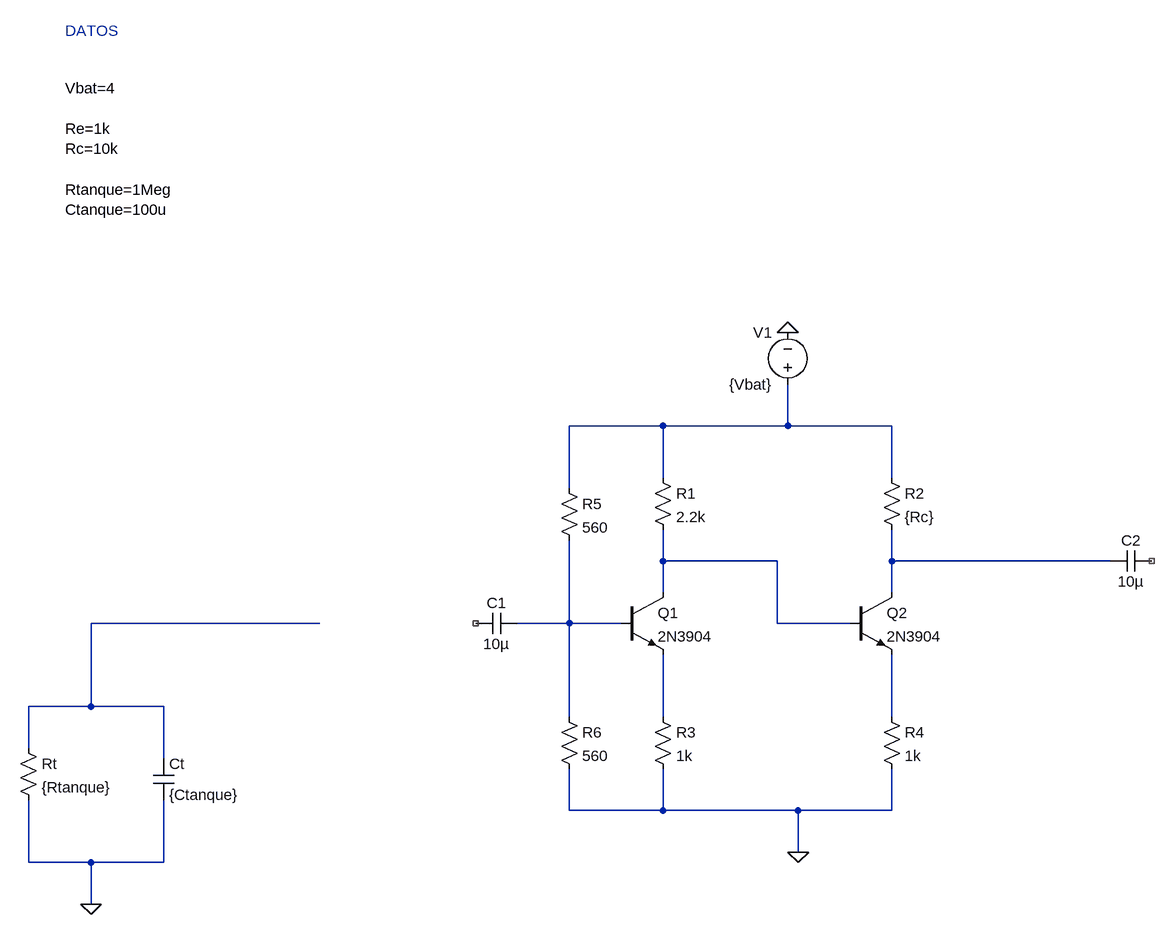
[diagram p0: schematic Draft12.asc]
Draft12.asc, the LTspice schematic file:
Version 4
SHEET 1 1752 680
WIRE 992 -368 848 -368
WIRE 1184 -368 1184 -432
WIRE 1184 -368 992 -368
WIRE 1344 -368 1184 -368
WIRE 992 -288 992 -368
WIRE 1344 -288 1344 -368
WIRE 848 -272 848 -368
WIRE 992 -160 992 -208
WIRE 1168 -160 992 -160
WIRE 1344 -160 1344 -208
WIRE 1680 -160 1344 -160
WIRE 992 -112 992 -160
WIRE 1344 -112 1344 -160
WIRE 464 -64 112 -64
WIRE 848 -64 848 -192
WIRE 848 -64 768 -64
WIRE 928 -64 848 -64
WIRE 1168 -64 1168 -160
WIRE 1280 -64 1168 -64
WIRE 112 64 112 -64
WIRE 112 64 16 64
WIRE 224 64 112 64
WIRE 848 80 848 -64
WIRE 992 80 992 -16
WIRE 1344 80 1344 -16
WIRE 16 128 16 64
WIRE 224 144 224 64
WIRE 848 224 848 160
WIRE 992 224 992 160
WIRE 992 224 848 224
WIRE 1200 224 992 224
WIRE 1344 224 1344 160
WIRE 1344 224 1200 224
WIRE 1200 288 1200 224
WIRE 16 304 16 208
WIRE 112 304 16 304
WIRE 224 304 224 208
WIRE 224 304 112 304
WIRE 112 368 112 304
FLAG 112 368 0
FLAG 1200 288 0
FLAG 1184 -512 0
SYMBOL res 0 112 R0
SYMATTR InstName Rt
SYMATTR Value {Rtanque}
SYMBOL cap 208 144 R0
SYMATTR InstName Ct
SYMATTR Value {Ctanque}
SYMBOL npn 928 -112 R0
SYMATTR InstName Q1
SYMATTR Value 2N3904
SYMBOL npn 1280 -112 R0
SYMATTR InstName Q2
SYMATTR Value 2N3904
SYMBOL res 976 -304 R0
SYMATTR InstName R1
SYMATTR Value 2.2k
SYMBOL res 1328 -304 R0
SYMATTR InstName R2
SYMATTR Value {Rc}
SYMBOL res 976 64 R0
SYMATTR InstName R3
SYMATTR Value 1k
SYMBOL res 1328 64 R0
SYMATTR InstName R4
SYMATTR Value 1k
SYMBOL cap 768 -80 R90
WINDOW 0 0 32 VBottom 2
WINDOW 3 32 32 VTop 2
SYMATTR InstName C1
SYMATTR Value 10µ
SYMBOL cap 1744 -176 R90
WINDOW 0 0 32 VBottom 2
WINDOW 3 32 32 VTop 2
SYMATTR InstName C2
SYMATTR Value 10µ
SYMBOL voltage 1184 -416 R180
WINDOW 0 24 96 Left 2
WINDOW 3 24 16 Left 2
SYMATTR InstName V1
SYMATTR Value {Vbat}
SYMBOL res 832 -288 R0
SYMATTR InstName R5
SYMATTR Value 560
SYMBOL res 832 64 R0
SYMATTR InstName R6
SYMATTR Value 560
TEXT 72 -888 Left 2 !Vbat=4\n \nRe=1k\nRc=10k\n \nRtanque=1Meg\nCtanque=100u
TEXT 72 -976 Left 2 ;DATOS

The netlist it stands for:
* Draft12.asc
Rt N004 0 {Rtanque}
Ct N004 0 {Ctanque}
Q1 N002 N005 N006 0 2N3904
Q2 N003 N002 N007 0 2N3904
R1 N001 N002 2.2k
R2 N001 N003 {Rc}
R3 N006 0 1k
R4 N007 0 1k
C1 N005 NC_01 10µ
C2 NC_02 N003 10µ
V1 N001 0 {Vbat}
R5 N001 N005 560
R6 N005 0 560
.model NPN NPN
.model PNP PNP
.lib standard.bjt
Vbat=4
Re=1k
Rc=10k
Rtanque=1Meg
Ctanque=100u
* DATOS
.backanno
.end